# Altium schematic sheet PowerSupply.SchDoc
size A
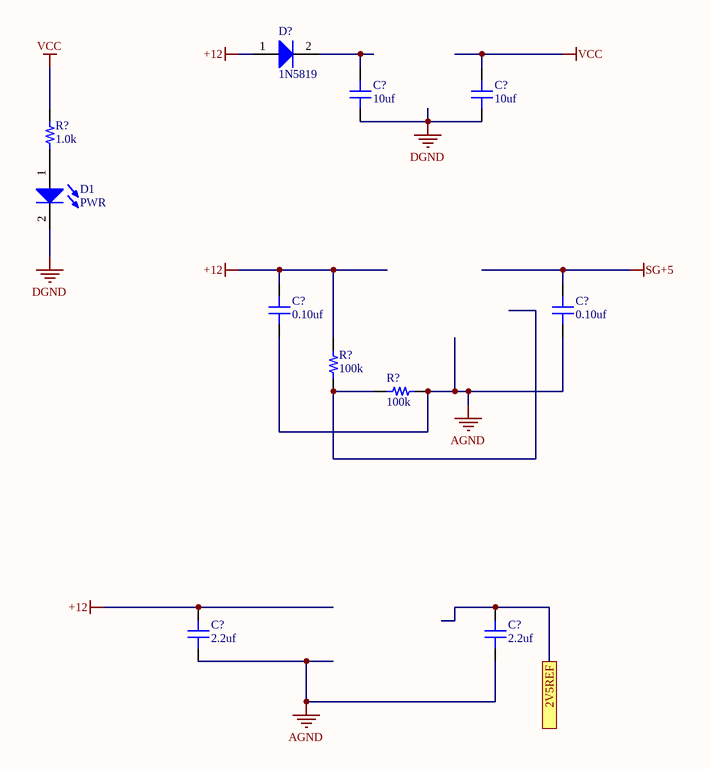
[diagram p0: PowerSupply.SchDoc]

## Parts
(Parts that share a designator on the sheet are numbered #1, #2 ... from top to bottom, then left to right.)
C?#1  value 10uf  [CAP 0603/1608]  (hidden comment: Capacitor MLCC 10uf 16V CAP 0603/1608)
C?#2  value 10uf  [CAP 0603/1608]  (hidden comment: Capacitor MLCC 10uf 16V CAP 0603/1608)
C?#3  value 0.10uf  [CAP 0603/1608]  (hidden comment: Capacitor MLCC 0.10uf 25V CAP 0603/1608)
C?#4  value 0.10uf  [CAP 0603/1608]  (hidden comment: Capacitor MLCC 0.10uf 25V CAP 0603/1608)
C?#5  value 2.2uf  [CAP 0603/1608]  (hidden comment: Capacitor MLCC 2.2uf 16V CAP 0603/1608)
C?#6  value 2.2uf  [CAP 0603/1608]  (hidden comment: Capacitor MLCC 2.2uf 16V CAP 0603/1608)
D1  PWR  [0805_LED]
D?  1N5819  [DIODE DO-214AC(SMA)]
R?#1  value 1.0k  [RES 0805/2012]  (hidden comment: Resistor 1.0k 0805 1/10W 1%)
R?#2  value 100k  [RES 0805/2012]  (hidden comment: Resistor 100k 0805 1/2W 1%)
R?#3  value 100k  [RES 0805/2012]  (hidden comment: Resistor 100k 0805 1/2W 1%)

## Ports
2V5REF

## Nets
+12: C?#3.2 C?#5.2 D?.1(A) R?#2.2
AGND: C?#3.1 C?#4.1 C?#5.1 C?#6.1 R?#3.2
DGND: C?#1.1 C?#2.1 D1.2(K)
SG+5: C?#4.2
VCC: C?#2.2 R?#1.2
2V5REF: C?#6.2 ; port 2V5REF
NetC?#1_2: C?#1.2 D?.2(K)
NetD1_1: D1.1(A) R?#1.1
NetR?#2_1: R?#2.1 R?#3.1

## Library data of the parts
C?#1 C?#2 = 235: Manufacturer_id: 1; idCapacitor: 235; Name: Cap_10uf_16V_CAP 0603/1608; Dielectric: Ceramic; Created_By: Nick Mah; Drawer_id: 1; Voltage_Rating: 16V; Package: CAP 0603/1608; Created_Date: 10/20/2018
C?#3 C?#4 = 583: Manufacturer_id: 1; idCapacitor: 583; Name: Cap_0.10uf_25V_CAP 0603/1608; Dielectric: Ceramic; Created_By: Nick Mah; Drawer_id: 1; Voltage_Rating: 25V; Package: CAP 0603/1608; Created_Date: 10/20/2018
C?#5 C?#6 = 231: Manufacturer_id: 1; idCapacitor: 231; Name: Cap_2.2uf_16V_CAP 0603/1608; Dielectric: Ceramic; Created_By: Nick Mah; Drawer_id: 1; Voltage_Rating: 16V; Package: CAP 0603/1608; Created_Date: 10/20/2018
D1 = 2: Manufacturer_id: 1; idLED: 2; Name: LED_0805_GREEN; Value: Green; Brightness: 35mcd; Id: 20mA; Vf: 2V; Drawer_id: 1
D? = 2: Manufacturer_id: 1; idDiode: 2; Ic: 1A; Power: 40V; Drawer_id: 1; Name: 1N5819
R?#1 = 505: Manufacturer_id: 1; idResistor: 505; Name: Res_1.0k_0805_1/10W_1%; Created_By: Nick Mah; Supplier 1: Digi-Key; Drawer_id: 1; Tolerance: 1%; Power: 1/10W; Package: 0805; ComponentLink1Description: Datasheet; Created_Date: 2018-10-20
R?#2 R?#3 = 985: Manufacturer_id: 1; idResistor: 985; Name: Res_100k_0805_1/2W_1%; Created_By: Nick Mah; Supplier 1: Digi-Key; Drawer_id: 1; Tolerance: 1%; Power: 1/2W; Package: 0805; ComponentLink1Description: Datasheet; Created_Date: 2018-10-20